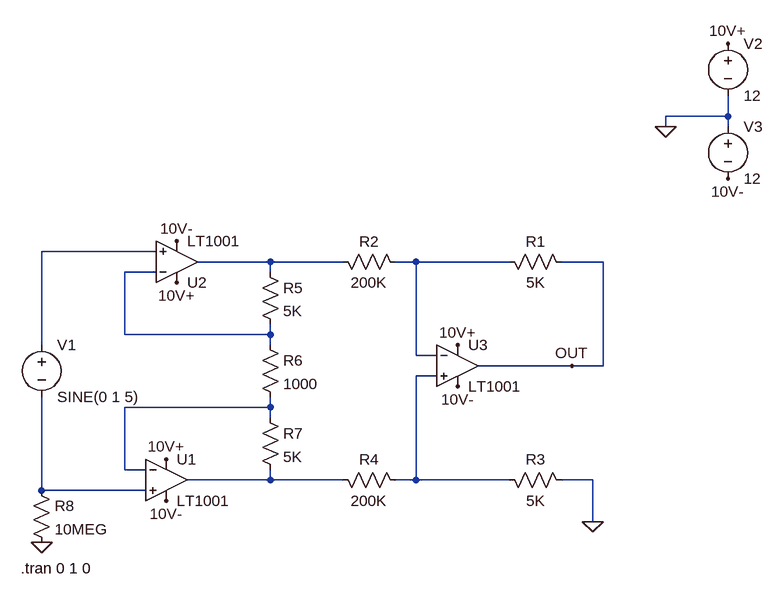
[diagram p0: schematic InAmp.asc]
InAmp.asc, the LTspice schematic file:
Version 4
SHEET 1 1036 680
WIRE 976 -288 976 -320
WIRE 976 -288 880 -288
WIRE 880 -272 880 -288
WIRE 976 -272 976 -288
WIRE 96 -80 -80 -80
WIRE 272 -64 160 -64
WIRE 384 -64 272 -64
WIRE 496 -64 464 -64
WIRE 640 -64 496 -64
WIRE 784 -64 720 -64
WIRE 96 -48 48 -48
WIRE 272 -48 272 -64
WIRE 48 48 48 -48
WIRE 272 48 272 32
WIRE 272 48 48 48
WIRE -80 64 -80 -80
WIRE 272 64 272 48
WIRE 496 80 496 -64
WIRE 528 80 496 80
WIRE 736 96 592 96
WIRE 784 96 784 -64
WIRE 784 96 736 96
WIRE 528 112 496 112
WIRE 272 160 272 144
WIRE 272 160 48 160
WIRE 272 176 272 160
WIRE 48 256 48 160
WIRE 80 256 48 256
WIRE 272 272 272 256
WIRE 272 272 144 272
WIRE 384 272 272 272
WIRE 496 272 496 112
WIRE 496 272 464 272
WIRE 640 272 496 272
WIRE 768 272 720 272
WIRE -80 288 -80 144
WIRE 80 288 -80 288
WIRE 768 336 768 272
FLAG 128 -32 10V+
FLAG 112 240 10V+
FLAG 560 64 10V+
FLAG 128 -96 10V-
FLAG 560 128 10V-
FLAG 112 304 10V-
FLAG 880 -272 0
FLAG 768 336 0
FLAG -80 368 0
FLAG 976 -192 10V-
FLAG 976 -400 10V+
FLAG 736 96 OUT
SYMBOL LT1001 112 208 R0
SYMATTR InstName U1
SYMBOL LT1001 128 0 M180
SYMATTR InstName U2
SYMBOL LT1001 560 32 R0
SYMATTR InstName U3
SYMBOL res 624 -80 M90
WINDOW 0 0 56 VBottom 2
WINDOW 3 32 56 VTop 2
SYMATTR InstName R1
SYMATTR Value 5K
SYMBOL res 368 -80 M90
WINDOW 0 0 56 VBottom 2
WINDOW 3 32 56 VTop 2
SYMATTR InstName R2
SYMATTR Value 200K
SYMBOL res 624 256 M90
WINDOW 0 0 56 VBottom 2
WINDOW 3 32 56 VTop 2
SYMATTR InstName R3
SYMATTR Value 5K
SYMBOL res 368 256 M90
WINDOW 0 0 56 VBottom 2
WINDOW 3 32 56 VTop 2
SYMATTR InstName R4
SYMATTR Value 200K
SYMBOL res 256 -64 R0
SYMATTR InstName R5
SYMATTR Value 5K
SYMBOL res 256 160 R0
SYMATTR InstName R7
SYMATTR Value 5K
SYMBOL voltage -80 48 R0
WINDOW 123 0 0 Left 2
WINDOW 39 0 0 Left 2
SYMATTR InstName V1
SYMATTR Value SINE(0 1 5)
SYMBOL voltage 976 -416 R0
WINDOW 123 0 0 Left 2
WINDOW 39 0 0 Left 2
SYMATTR InstName V2
SYMATTR Value 12
SYMBOL voltage 976 -288 R0
WINDOW 123 0 0 Left 2
WINDOW 39 0 0 Left 2
SYMATTR InstName V3
SYMATTR Value 12
SYMBOL res -96 272 R0
SYMATTR InstName R8
SYMATTR Value 10MEG
SYMBOL res 256 48 R0
SYMATTR InstName R6
SYMATTR Value 1000
TEXT -112 408 Left 2 !.tran 0 1 0

The netlist it stands for:
* InAmp.asc
XU1 N008 N006 10V+ 10V- N007 LT1001  ; pins In+ In- V+ V- OUT
XU2 N001 N004 10V+ 10V- N002 LT1001  ; pins In+ In- V+ V- OUT
XU3 N005 N003 10V+ 10V- OUT LT1001  ; pins In+ In- V+ V- OUT
R1 N003 OUT 5K
R2 N002 N003 200K
R3 N005 0 5K
R4 N007 N005 200K
R5 N002 N004 5K
R7 N006 N007 5K
V1 N001 N008 SINE(0 1 5)
V2 10V+ 0 12
V3 0 10V- 12
R8 N008 0 10MEG
R6 N004 N006 1000
.tran 0 1 0
.lib LTC.lib
.backanno
.end